# Altium schematic sheet L298.SchDoc
size A
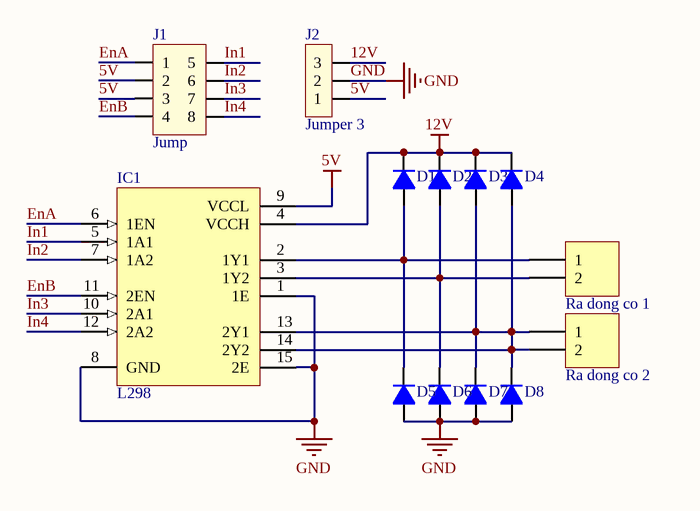
[diagram p0: L298.SchDoc]

## Parts
D1  (no value)  [D1A]
D2  (no value)  [D1A]
D3  (no value)  [D1A]
D4  (no value)  [D1A]
D5  (no value)  [D1A]
D6  (no value)  [D1A]
D7  (no value)  [D1A]
D8  (no value)  [D1A]
IC1  L298  [DIP15SL2]
J1  Jump  [JP4x2]
J2  Jumper 3  [JP3]
Ra_dong_co_1  Header 2  [JP2]  (value not drawn)
Ra_dong_co_2  Header 2  [JP2]  (value not drawn)

## Nets
5V: IC1.9(VCCL) J1.2 J1.3 J2.1
12V: D1.2(K) D2.2(K) D3.2(K) D4.2(K) IC1.4(VCCH) J2.3
GND: D5.1(A) D6.1(A) D7.1(A) D8.1(A) IC1.1(1E) IC1.8(GND) IC1.15(2E) J2.2
EnA: IC1.6(1EN) J1.1
EnB: IC1.11(2EN) J1.4
In1: IC1.5(1A1) J1.5
In2: IC1.7(1A2) J1.6
In3: IC1.10(2A1) J1.7
In4: IC1.12(2A2) J1.8
NetD1_1: D1.1(A) D5.2(K) IC1.2(1Y1) Ra_dong_co_1.1
NetD2_1: D2.1(A) D6.2(K) IC1.3(1Y2) Ra_dong_co_1.2
NetD3_1: D3.1(A) D4.1(A) D7.2(K) D8.2(K) IC1.13(2Y1) IC1.14(2Y2) Ra_dong_co_2.1 Ra_dong_co_2.2

## Library data of the parts
D1-D8 = D1A: Diode 1A; Value: 1N4007
IC1 = L298: Dual Full-H Driver; Note: The tab is elec is connected to GND pin; Published: 15-May-2002; DatasheetVersion: Jun-1990; PackageReference: KV015; Publisher: Altium Limited; PackageDescription: TO, Thru-Hole, Vertical, Heatsink Mounted; 15 Bent Staggered Leads; Pitch 1.27 mm; ComponentLink1Description: Manufacturer Link; ComponentLink1URL: http://www.ti.com/
J1 = JP4x2: Connector 4x2; Value: Connector 4x2
J2 = JP3: Value: J3
Ra_dong_co_1 Ra_dong_co_2 = Header 2: Header, 2-Pin; LatestRevisionDate: 17-Jul-2002; LatestRevisionNote: Re-released for DXP Platform.; Publisher: Altium Limited